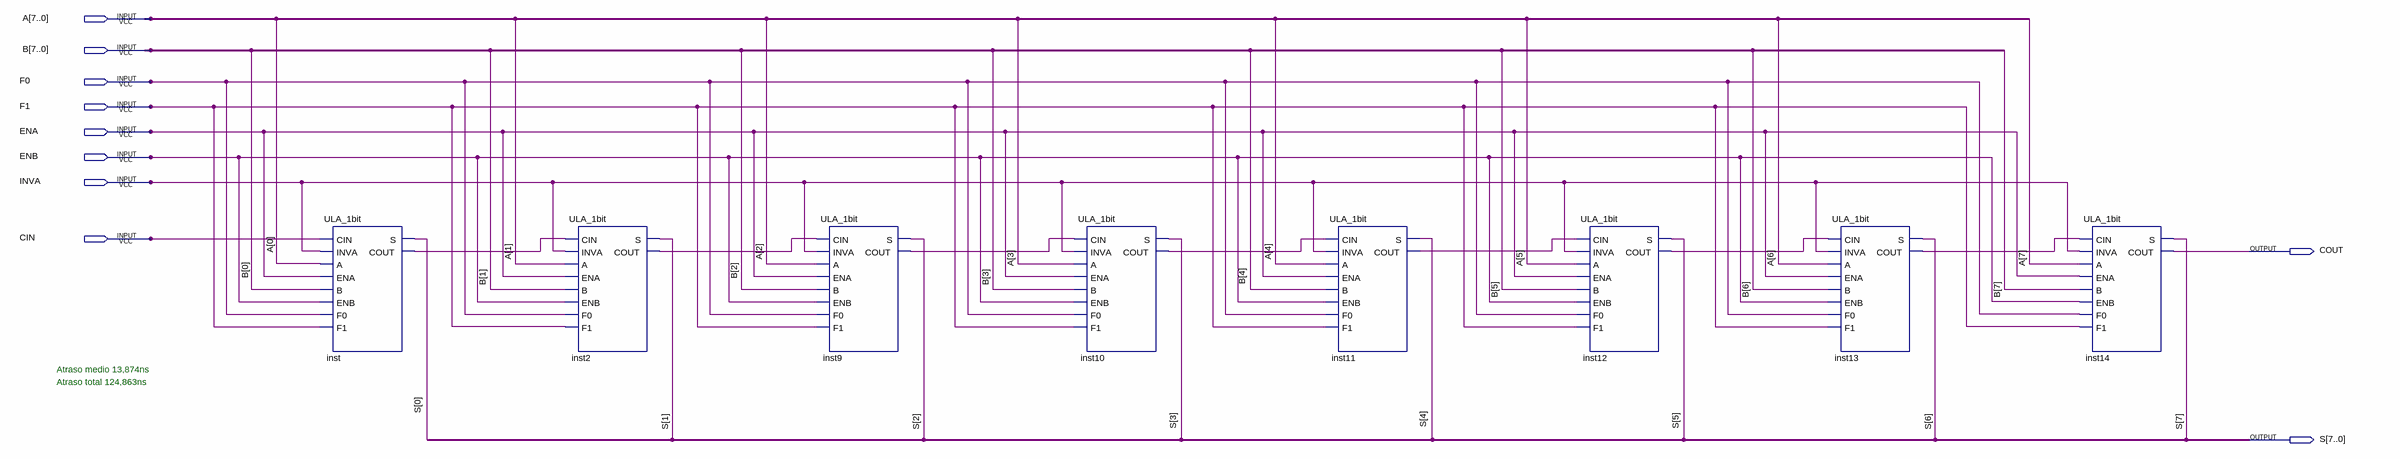
[diagram p0: schematic sheet]
// Quartus schematic ULA_8bit.bdf as structural Verilog: 8 symbols, 10 pins
module ULA_8bit (
  input  [7:0] A,
  input  [7:0] B,
  input  F0,
  input  F1,
  input  ENA,
  input  ENB,
  input  INVA,
  input  CIN,
  output COUT,
  output [7:0] S
);

  wire inst2_cout, inst9_cout, inst10_cout, inst11_cout, inst12_cout, inst13_cout, inst_cout;

  ULA_1bit inst (
    .CIN(CIN), .INVA(INVA), .A(A[0]), .ENA(ENA), .B(B[0]), .ENB(ENB), .F0(F0), .F1(F1), .S(S[0]),
    .COUT(inst_cout));
  ULA_1bit inst2 (
    .CIN(inst_cout), .INVA(INVA), .A(A[1]), .ENA(ENA), .B(B[1]), .ENB(ENB), .F0(F0), .F1(F1), .S(S[1]),
    .COUT(inst2_cout));
  ULA_1bit inst9 (
    .CIN(inst2_cout), .INVA(INVA), .A(A[2]), .ENA(ENA), .B(B[2]), .ENB(ENB), .F0(F0), .F1(F1), .S(S[2]),
    .COUT(inst9_cout));
  ULA_1bit inst10 (
    .CIN(inst9_cout), .INVA(INVA), .A(A[3]), .ENA(ENA), .B(B[3]), .ENB(ENB), .F0(F0), .F1(F1), .S(S[3]),
    .COUT(inst10_cout));
  ULA_1bit inst11 (
    .CIN(inst10_cout), .INVA(INVA), .A(A[4]), .ENA(ENA), .B(B[4]), .ENB(ENB), .F0(F0), .F1(F1), .S(S[4]),
    .COUT(inst11_cout));
  ULA_1bit inst12 (
    .CIN(inst11_cout), .INVA(INVA), .A(A[5]), .ENA(ENA), .B(B[5]), .ENB(ENB), .F0(F0), .F1(F1), .S(S[5]),
    .COUT(inst12_cout));
  ULA_1bit inst13 (
    .CIN(inst12_cout), .INVA(INVA), .A(A[6]), .ENA(ENA), .B(B[6]), .ENB(ENB), .F0(F0), .F1(F1), .S(S[6]),
    .COUT(inst13_cout));
  ULA_1bit inst14 (
    .CIN(inst13_cout), .INVA(INVA), .A(A[7]), .ENA(ENA), .B(B[7]), .ENB(ENB), .F0(F0), .F1(F1), .S(S[7]),
    .COUT(COUT));

  // Notes on the sheet:
  //   Atraso medio 13,874ns
  //   Atraso total 124,863ns
endmodule
